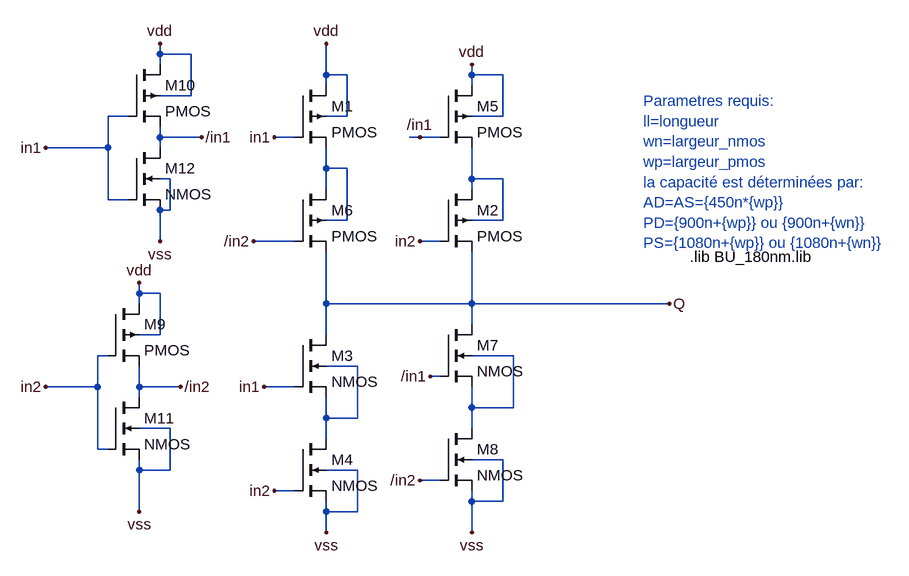
[diagram p0: schematic xor.asc]
xor.asc, the LTspice schematic file:
Version 4
SHEET 1 1268 996
WIRE 64 -16 64 -32
WIRE 112 -16 64 -16
WIRE 64 0 64 -16
WIRE 320 16 320 -32
WIRE 352 16 320 16
WIRE 544 16 544 0
WIRE 592 16 544 16
WIRE 320 32 320 16
WIRE 544 32 544 16
WIRE 112 48 112 -16
WIRE 112 48 64 48
WIRE 16 80 -16 80
WIRE 352 80 352 16
WIRE 352 80 320 80
WIRE 592 80 592 16
WIRE 592 80 544 80
WIRE 64 112 64 96
WIRE 128 112 64 112
WIRE 272 112 240 112
WIRE 464 112 448 112
WIRE 496 112 464 112
WIRE -16 128 -16 80
WIRE -16 128 -112 128
WIRE 64 128 64 112
WIRE 320 160 320 128
WIRE 352 160 320 160
WIRE 80 176 64 176
WIRE 544 176 544 128
WIRE 592 176 544 176
WIRE 320 192 320 160
WIRE 544 192 544 176
WIRE -16 208 -16 128
WIRE 16 208 -16 208
WIRE 80 224 80 176
WIRE 80 224 64 224
WIRE 352 240 352 160
WIRE 352 240 320 240
WIRE 592 240 592 176
WIRE 592 240 544 240
WIRE 64 272 64 224
WIRE 272 272 208 272
WIRE 496 272 464 272
WIRE 32 352 32 336
WIRE 64 352 32 352
WIRE 32 368 32 352
WIRE 320 368 320 288
WIRE 544 368 544 288
WIRE 544 368 320 368
WIRE 848 368 544 368
WIRE 544 400 544 368
WIRE 64 416 64 352
WIRE 64 416 32 416
WIRE 320 416 320 368
WIRE -16 448 -32 448
WIRE 608 448 544 448
WIRE 368 464 320 464
WIRE 496 480 480 480
WIRE -32 496 -32 448
WIRE -32 496 -112 496
WIRE 32 496 32 464
WIRE 96 496 32 496
WIRE 272 496 224 496
WIRE 32 512 32 496
WIRE 544 528 544 496
WIRE 608 528 608 448
WIRE 608 528 544 528
WIRE 320 544 320 512
WIRE 368 544 368 464
WIRE 368 544 320 544
WIRE 80 560 32 560
WIRE 544 560 544 528
WIRE 320 576 320 544
WIRE -32 592 -32 496
WIRE -16 592 -32 592
WIRE 592 608 544 608
WIRE 32 624 32 608
WIRE 80 624 80 560
WIRE 80 624 32 624
WIRE 368 624 320 624
WIRE 496 640 464 640
WIRE 272 656 240 656
WIRE 544 672 544 656
WIRE 592 672 592 608
WIRE 592 672 544 672
WIRE 32 688 32 624
WIRE 320 688 320 672
WIRE 368 688 368 624
WIRE 368 688 320 688
WIRE 320 720 320 688
WIRE 544 720 544 672
FLAG -112 128 in1
FLAG -112 496 in2
FLAG 320 720 vss
FLAG 320 -32 vdd
FLAG 848 368 Q
FLAG 128 112 /in1
FLAG 96 496 /in2
FLAG 64 -32 vdd
FLAG 32 336 vdd
FLAG 32 688 vss
FLAG 64 272 vss
FLAG 544 720 vss
FLAG 544 0 vdd
FLAG 240 112 in1
FLAG 224 496 in1
FLAG 240 656 in2
FLAG 464 272 in2
FLAG 464 112 /in1
FLAG 208 272 /in2
FLAG 464 640 /in2
FLAG 480 480 /in1
SYMBOL pmos4 272 32 R0
SYMATTR InstName M1
SYMATTR Value2 l={ll} w={wp} ad={450n*{wp}} as={450n*{wp}} pd={900n+{wp}} ps={1080n+{wp}}
SYMBOL pmos4 496 192 R0
SYMATTR InstName M2
SYMATTR Value2 l={ll} w={wp} ad={450n*{wp}} as={450n*{wp}} pd={900n+{wp}} ps={1080n+{wp}}
SYMBOL nmos4 496 400 R0
SYMATTR InstName M7
SYMATTR Value2 l={ll} w={wn} ad={450n*{wn}} as={450n*{wn}} pd={900n+{wn}} ps={1080n+{wn}}
SYMBOL nmos4 496 560 R0
SYMATTR InstName M8
SYMATTR Value2 l={ll} w={wn} ad={450n*{wn}} as={450n*{wn}} pd={900n+{wn}} ps={1080n+{wn}}
SYMBOL pmos4 496 32 R0
SYMATTR InstName M5
SYMATTR Value2 l={ll} w={wp} ad={450n*{wp}} as={450n*{wp}} pd={900n+{wp}} ps={1080n+{wp}}
SYMBOL pmos4 272 192 R0
SYMATTR InstName M6
SYMATTR Value2 l={ll} w={wp} ad={450n*{wp}} as={450n*{wp}} pd={900n+{wp}} ps={1080n+{wp}}
SYMBOL pmos4 -16 368 R0
SYMATTR InstName M9
SYMATTR Value2 l={ll} w={wp} ad={450n*{wp}} as={450n*{wp}} pd={900n+{wp}} ps={1080n+{wp}}
SYMBOL pmos4 16 0 R0
SYMATTR InstName M10
SYMATTR Value2 l={ll} w={wp} ad={450n*{wp}} as={450n*{wp}} pd={900n+{wp}} ps={1080n+{wp}}
SYMBOL nmos4 -16 512 R0
SYMATTR InstName M11
SYMATTR Value2 l={ll} w={wn} ad={450n*{wn}} as={450n*{wn}} pd={900n+{wn}} ps={1080n+{wn}}
SYMBOL nmos4 16 128 R0
SYMATTR InstName M12
SYMATTR Value2 l={ll} w={wn} ad={450n*{wn}} as={450n*{wn}} pd={900n+{wn}} ps={1080n+{wn}}
SYMBOL nmos4 272 416 R0
SYMATTR InstName M3
SYMATTR Value2 l={ll} w={wn} ad={450n*{wn}} as={450n*{wn}} pd={900n+{wn}} ps={1080n+{wn}}
SYMBOL nmos4 272 576 R0
SYMATTR InstName M4
SYMATTR Value2 l={ll} w={wn} ad={450n*{wn}} as={450n*{wn}} pd={900n+{wn}} ps={1080n+{wn}}
TEXT 880 296 Left 2 !.lib BU_180nm.lib
TEXT 808 56 Left 2 ;Parametres requis: \nll=longueur \nwn=largeur_nmos \nwp=largeur_pmos\nla capacité est déterminées par:\nAD=AS={450n*{wp}}\nPD={900n+{wp}} ou {900n+{wn}}\nPS={1080n+{wp}} ou {1080n+{wn}}

The netlist it stands for:
* xor.asc
M1 vdd in1 N001 vdd PMOS l={ll} w={wp} ad={450n*{wp}} as={450n*{wp}} pd={900n+{wp}} ps={1080n+{wp}}
M2 N002 in2 Q N002 PMOS l={ll} w={wp} ad={450n*{wp}} as={450n*{wp}} pd={900n+{wp}} ps={1080n+{wp}}
M7 Q /in1 N003 N003 NMOS l={ll} w={wn} ad={450n*{wn}} as={450n*{wn}} pd={900n+{wn}} ps={1080n+{wn}}
M8 N003 /in2 vss vss NMOS l={ll} w={wn} ad={450n*{wn}} as={450n*{wn}} pd={900n+{wn}} ps={1080n+{wn}}
M5 vdd /in1 N002 vdd PMOS l={ll} w={wp} ad={450n*{wp}} as={450n*{wp}} pd={900n+{wp}} ps={1080n+{wp}}
M6 N001 /in2 Q N001 PMOS l={ll} w={wp} ad={450n*{wp}} as={450n*{wp}} pd={900n+{wp}} ps={1080n+{wp}}
M9 vdd in2 /in2 vdd PMOS l={ll} w={wp} ad={450n*{wp}} as={450n*{wp}} pd={900n+{wp}} ps={1080n+{wp}}
M10 vdd in1 /in1 vdd PMOS l={ll} w={wp} ad={450n*{wp}} as={450n*{wp}} pd={900n+{wp}} ps={1080n+{wp}}
M11 /in2 in2 vss vss NMOS l={ll} w={wn} ad={450n*{wn}} as={450n*{wn}} pd={900n+{wn}} ps={1080n+{wn}}
M12 /in1 in1 vss vss NMOS l={ll} w={wn} ad={450n*{wn}} as={450n*{wn}} pd={900n+{wn}} ps={1080n+{wn}}
M3 Q in1 N004 N004 NMOS l={ll} w={wn} ad={450n*{wn}} as={450n*{wn}} pd={900n+{wn}} ps={1080n+{wn}}
M4 N004 in2 vss vss NMOS l={ll} w={wn} ad={450n*{wn}} as={450n*{wn}} pd={900n+{wn}} ps={1080n+{wn}}
.model NMOS NMOS
.model PMOS PMOS
.lib standard.mos
.lib BU_180nm.lib
* Parametres requis:
* ll=longueur
* wn=largeur_nmos
* wp=largeur_pmos
* la capacité est déterminées par:
* AD=AS={450n*{wp}}
* PD={900n+{wp}} ou {900n+{wn}}
* PS={1080n+{wp}} ou {1080n+{wn}}
.backanno
.end